# EAGLE schematic NewWiring (EAGLE 7.7.0)
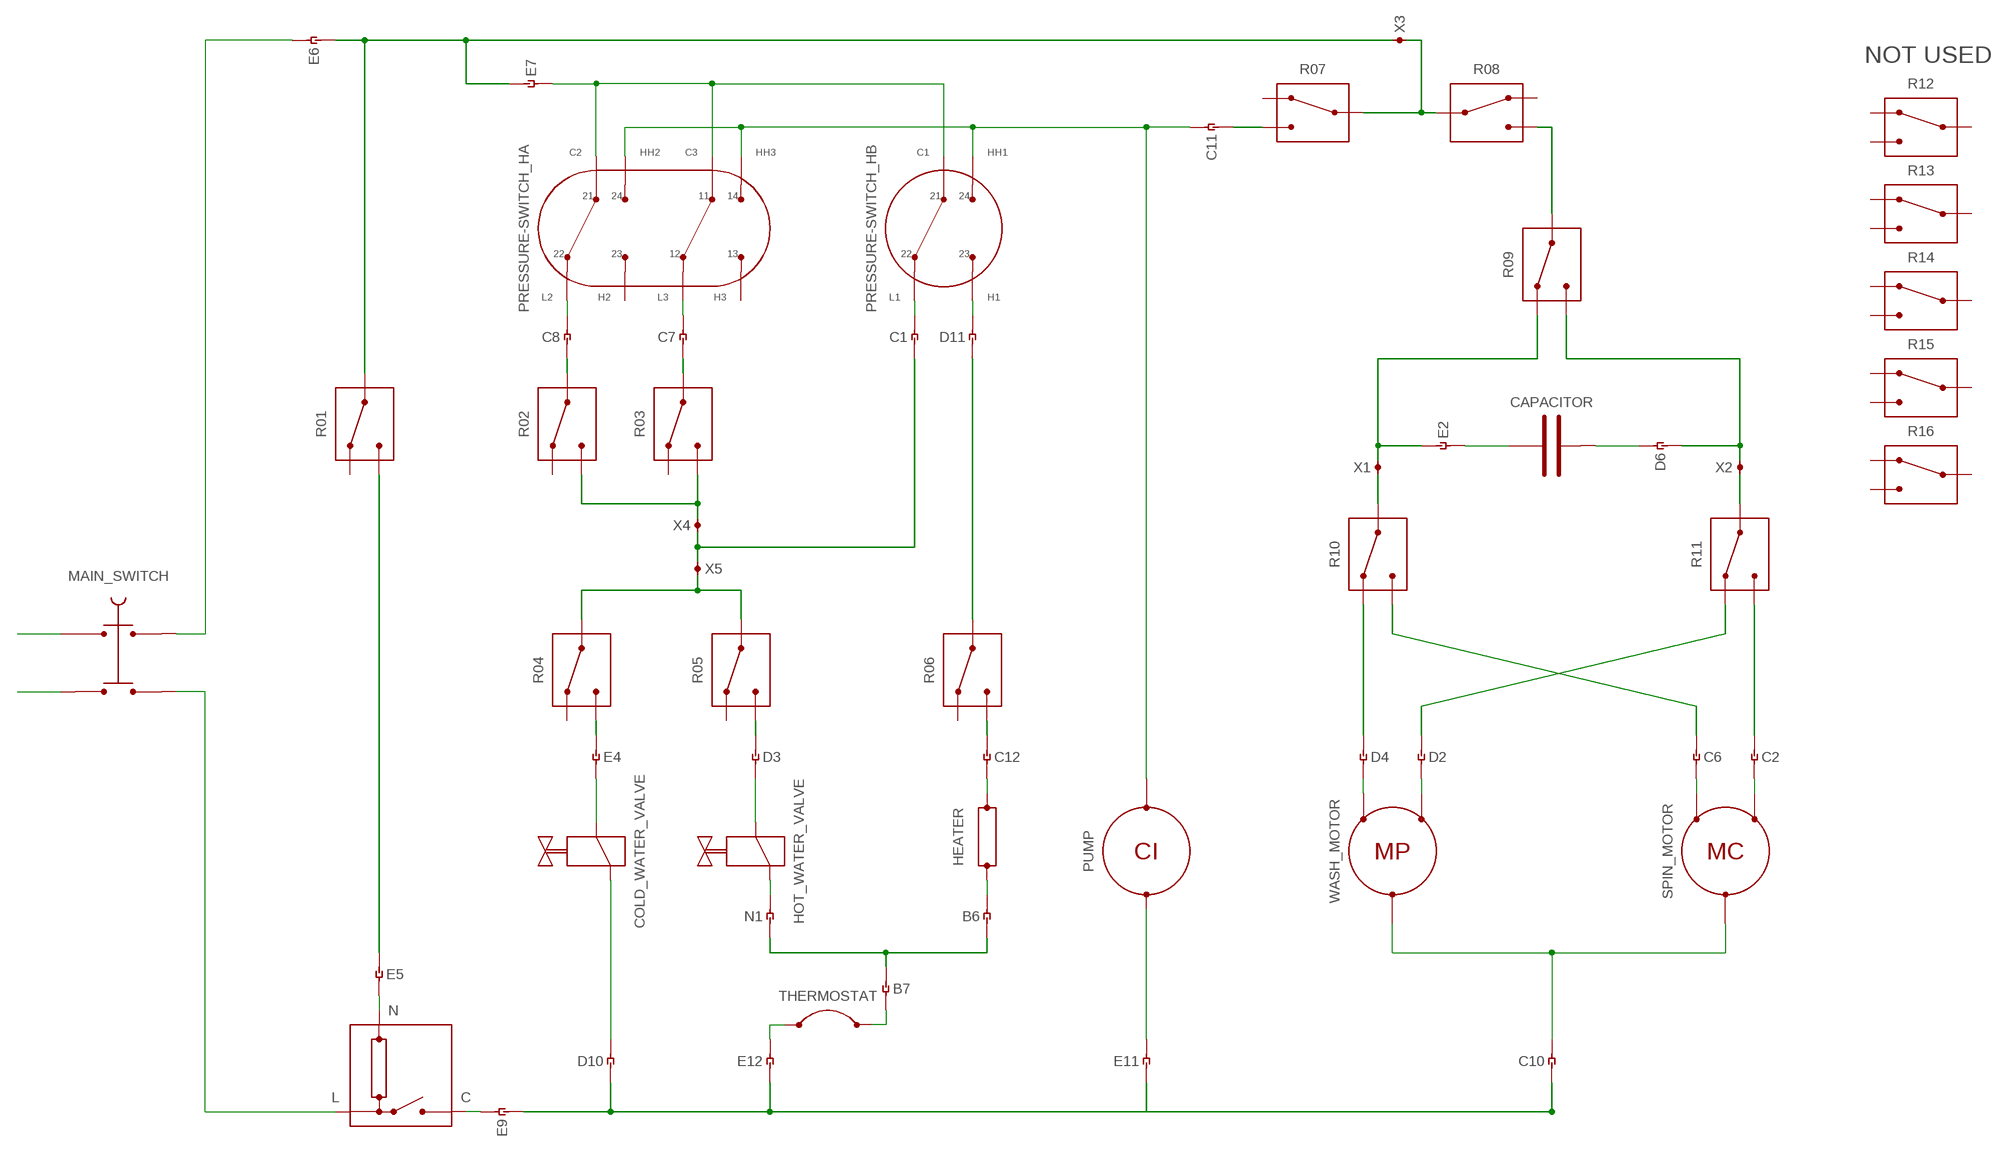
[diagram p0: schematic, sheet 1]

## Parts
B6  CABLE  [CABLE]
B7  CABLE  [CABLE]
C1  CABLE  [CABLE]
C2  CABLE  [CABLE]
C6  CABLE  [CABLE]
C7  CABLE  [CABLE]
C8  CABLE  [CABLE]
C10  CABLE  [CABLE]
C11  CABLE  [CABLE]
C12  CABLE  [CABLE]
CAPACITOR  CAPACITOR  [CAPACITOR]
COLD_WATER_VALVE  VALVE  [VALVE]
D2  CABLE  [CABLE]
D3  CABLE  [CABLE]
D4  CABLE  [CABLE]
D6  CABLE  [CABLE]
D10  CABLE  [CABLE]
D11  CABLE  [CABLE]
E2  CABLE  [CABLE]
E4  CABLE  [CABLE]
E5  CABLE  [CABLE]
E6  CABLE  [CABLE]
E7  CABLE  [CABLE]
E9  CABLE  [CABLE]
E11  CABLE  [CABLE]
E12  CABLE  [CABLE]
HEATER  HEATER  [HEATER]
HOT_WATER_VALVE  VALVE  [VALVE]
MAIN_SWITCH  SWITCH  [SWITCH]
N1  CABLE  [CABLE]
PRESSURE-SWITCH_HA  PS2  [PS2]
PRESSURE-SWITCH_HB  PS1  [PS1]
PUMP  CI  MOTOR-2  [MOTOR-2]
R01  RELAY  [RELAY]
R02  RELAY  [RELAY]
R03  RELAY  [RELAY]
R04  RELAY  [RELAY]
R05  RELAY  [RELAY]
R06  RELAY  [RELAY]
R07  RELAY  [RELAY]
R08  RELAY  [RELAY]
R09  RELAY  [RELAY]
R10  RELAY  [RELAY]
R11  RELAY  [RELAY]
R12  RELAY  [RELAY]
R13  RELAY  [RELAY]
R14  RELAY  [RELAY]
R15  RELAY  [RELAY]
R16  RELAY  [RELAY]
SPIN_MOTOR  MC  MOTOR-3  [MOTOR-3]
THERMOSTAT  THERMOSTAT  [THERMOSTAT]
U$1  LOCK  [LOCK]
WASH_MOTOR  MP  MOTOR-3  [MOTOR-3]
X1  DOMINO  [DOMINO]
X2  DOMINO  [DOMINO]
X3  DOMINO  [DOMINO]
X4  DOMINO  [DOMINO]
X5  DOMINO  [DOMINO]

## Nets
C1: C1.P$2(PIN2) PRESSURE-SWITCH_HB.P$3
C10: C10.P$2(PIN2) SPIN_MOTOR.MC WASH_MOTOR.MC
C11-OVERFLOW: C11.P$2(PIN2) PRESSURE-SWITCH_HA.P$5 PRESSURE-SWITCH_HA.P$8 PRESSURE-SWITCH_HB.P$2 PUMP.M1
D2: D2.P$2(PIN2) WASH_MOTOR.M3(M2)
D4: D4.P$2(PIN2) WASH_MOTOR.M1
D6: CAPACITOR.C2 D6.P$2(PIN2)
D10: COLD_WATER_VALVE.P$1 D10.P$2(PIN2)
D11: D11.P$2(PIN2) PRESSURE-SWITCH_HB.P$4
E5: E5.P$2(PIN2) U$1.N
E11: E11.P$2(PIN2) PUMP.M3(M2)
LIVE: C10.P$1(PIN1) D10.P$1(PIN1) E9.P$1(PIN1) E11.P$1(PIN1) E12.P$1(PIN1)
N$1: E6.P$2(PIN2) MAIN_SWITCH.O1(OUT1)
N$2: COLD_WATER_VALVE.P$2 E4.P$2(PIN2)
N$3: MAIN_SWITCH.O2(OUT2) U$1.L
N$4: D3.P$2(PIN2) HOT_WATER_VALVE.P$2
N$5: B6.P$1(PIN1) B7.P$1(PIN1) N1.P$1(PIN1)
N$6: E5.P$1(PIN1) R01.T
N$7: D4.P$1(PIN1) R10.R
N$8: MAIN_SWITCH.I1(IN1)
N$9: C2.P$1(PIN1) R11.T
N$10: MAIN_SWITCH.I2(IN2)
N$11: C6.P$1(PIN1) R10.T
N$12: R08.T R09.C
N$13: HOT_WATER_VALVE.P$1 N1.P$2(PIN2)
N$14: D2.P$1(PIN1) R11.R
N$15: R10.C X1.P$1(PIN1)
N$16: R02.T R03.T X4.P$2(PIN2)
N$17: C8.P$2(PIN2) PRESSURE-SWITCH_HA.P$2
N$18: C7.P$2(PIN2) PRESSURE-SWITCH_HA.P$6
N$19: C6.P$2(PIN2) SPIN_MOTOR.M1
N$20: E9.P$2(PIN2) U$1.C
N$21: C12.P$2(PIN2) HEATER.H2
N$22: E12.P$2(PIN2) THERMOSTAT.T2
N$23: C12.P$1(PIN1) R06.T
N$24: C11.P$1(PIN1) R07.T
N$25: D3.P$1(PIN1) R05.T
N$26: C2.P$2(PIN2) SPIN_MOTOR.M3(M2)
N$27: E2.P$1(PIN1) R09.R X1.P$2(PIN2)
N$28: B7.P$2(PIN2) THERMOSTAT.T1
N$29: B6.P$2(PIN2) HEATER.H1
N$30: D6.P$1(PIN1) R09.T X2.P$2(PIN2)
N$31: R11.C X2.P$1(PIN1)
N$32: R07.C R08.C X3.P$2(PIN2)
N$33 [Cable]: CAPACITOR.C1 E2.P$2(PIN2)
N$35: R04.C R05.C X5.P$2(PIN2)
N$39: E7.P$2(PIN2) PRESSURE-SWITCH_HA.P$1 PRESSURE-SWITCH_HA.P$4 PRESSURE-SWITCH_HB.P$1
N$42: C8.P$1(PIN1) R02.C
N$43: C7.P$1(PIN1) R03.C
N$45: D11.P$1(PIN1) R06.C
N$47: E4.P$1(PIN1) R04.T
NEUTRAL: E6.P$1(PIN1) E7.P$1(PIN1) R01.C X3.P$1(PIN1)
PHASE3: C1.P$1(PIN1) X4.P$1(PIN1) X5.P$1(PIN1)
Unconnected: PRESSURE-SWITCH_HA.P$3 PRESSURE-SWITCH_HA.P$7 R01.R R02.R R03.R R04.R R05.R R06.R R07.R R08.R R12.C R12.R R12.T R13.C R13.R R13.T R14.C R14.R R14.T R15.C R15.R R15.T R16.C R16.R R16.T

## Notes on the sheet
- NOT USED

## Library data of the parts
B6 B7 C1 C2 C6-C8 C10-C12 D2-D4 D6 D10 D11 E2 E4-E7 E9 E11 E12 N1 = Kostas:CABLE: CABLE CONNECTION MALE ON PCB FEMALE ON CABLE SIDE
CAPACITOR = Kostas:CAPACITOR
COLD_WATER_VALVE HOT_WATER_VALVE = Kostas:VALVE: Electrovalve
HEATER = Kostas:HEATER: HEATER
MAIN_SWITCH = Kostas:SWITCH: POWER SWITCH
PRESSURE-SWITCH_HA = Kostas:PS2: PRESSURE SWITCH - DOUBLE
PRESSURE-SWITCH_HB = Kostas:PS1: PRESSURE SWITCH - SIMPLE
PUMP = Kostas:MOTOR-2: MOTOR 2 PHASES
R01-R09 R10-R16 = Kostas:RELAY: RELAY
SPIN_MOTOR WASH_MOTOR = Kostas:MOTOR-3
THERMOSTAT = Kostas:THERMOSTAT: THERMOSTAT
U$1 = Kostas:LOCK: DOOR LOCK
X1-X5 = Kostas:DOMINO: DOMINO